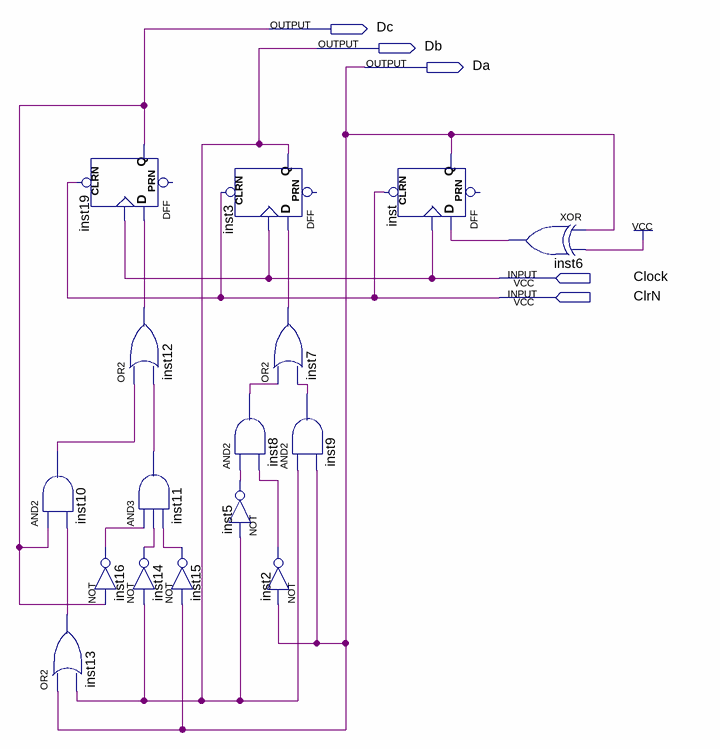
[diagram p0: schematic sheet]
// Quartus schematic DFFD2.bdf as structural Verilog: 16 symbols, 5 pins
module DFFD2 (
  input  Clock,
  input  ClrN,
  output Dc,
  output Db,
  output Da
);

  wire inst2_out, inst5_out, inst6_out, inst7_out, inst8_out, inst9_out, inst10_out, inst11_out, inst12_out,
       inst13_out, inst14_out, inst15_out, inst16_out;

  and inst10 (inst10_out, Dc, inst13_out);
  DFF inst19 (.CLRN(ClrN), .CLK(Clock), .D(inst12_out), .Q(Dc));  // open: PRN
  not inst16 (inst16_out, Dc);
  or inst13 (inst13_out, Da, Db);
  or inst12 (inst12_out, inst10_out, inst11_out);
  and inst11 (inst11_out, inst16_out, inst14_out, inst15_out);
  not inst14 (inst14_out, Db);
  not inst15 (inst15_out, Da);
  DFF inst3 (.CLRN(ClrN), .CLK(Clock), .D(inst7_out), .Q(Db));  // open: PRN
  or inst7 (inst7_out, inst8_out, inst9_out);
  and inst8 (inst8_out, inst5_out, inst2_out);
  not inst5 (inst5_out, Db);
  not inst2 (inst2_out, Da);
  and inst9 (inst9_out, Db, Da);
  DFF inst (.CLRN(ClrN), .CLK(Clock), .D(inst6_out), .Q(Da));  // open: PRN
  xor inst6 (inst6_out, Da, 1'b1);
endmodule
